# Altium project FMC_ADC_100M_10B_16CHA_TDC.PrjPCB (part 3 of 4)

## Sheet power_supply.SchDoc: FMC_ADC
size 420 x 297 mm; Author: G.Kasprowicz; CompanyName: WUT ISE; DrawnBy: G.Kasprowicz; Organization: WUT ISE; Address1: PW ISE; Address2: Nowowiejska 15/19 00-665 Warsaw; Address3: gkasprow@gmail.com; DocumentNumber: 10; Revision: 2; SheetNumber: 10; SheetTotal: 12; ModifiedBy: -; CheckedDate: -; Title2: Power supply; DivGrp: WUT ISE; Designer: G.Kasprowicz; ModifiedDate: -; ProjectName: Sensor Box
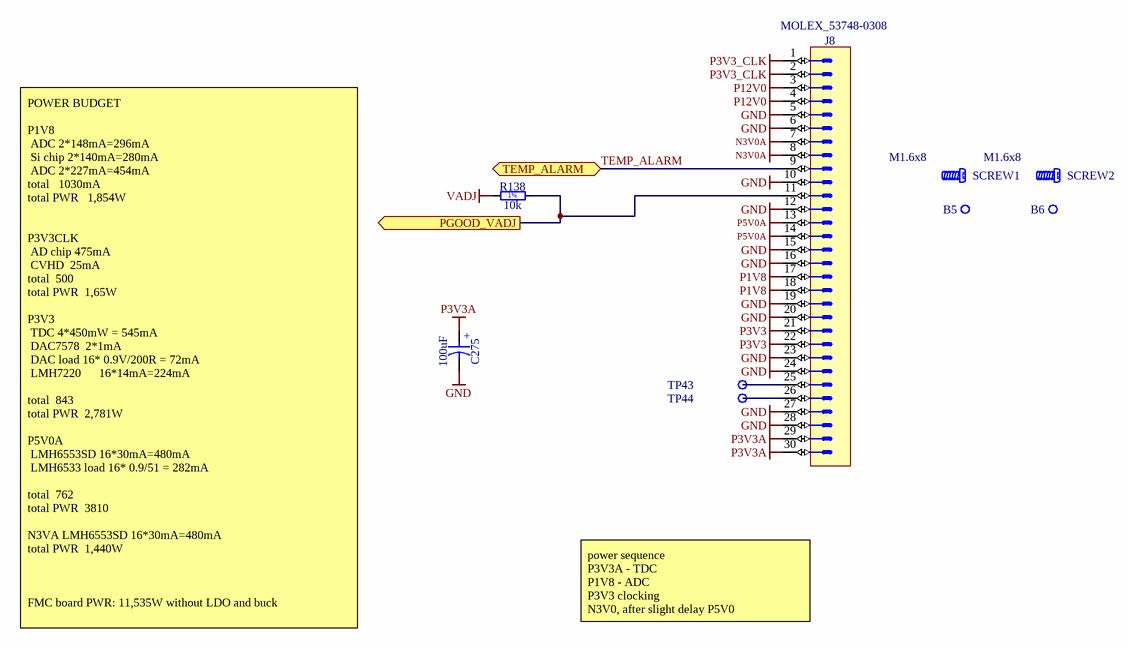
[diagram p6: power_supply.SchDoc]

### Parts
B5  Plated Hole  [c300h160]  (value not drawn)  (no BOM)
B6  Plated Hole  [c300h160]  (value not drawn)  (no BOM)
C275  100uF  [CAPMP3216X180N]
J8  SlimStack™  [MOLEX_53748-0308]  (value not drawn)
R138  10k  [RESC1005X40N]
SCREW1  M1.6x8  [BOSSARD_BN650-1243721_v]
SCREW2  M1.6x8  [BOSSARD_BN650-1243721_v]
TP43  Test Point  [TPS127]  (value not drawn)
TP44  Test Point  [TPS127]  (value not drawn)

### Ports
PGOOD_VADJ (out), TEMP_ALARM (bidir)

### Nets
GND: C275.2 J8.5 J8.6 J8.10 J8.12 J8.15 J8.16 J8.19 J8.20 J8.23 J8.24 J8.27 J8.28
N3V0A: J8.7 J8.8
P1V8: J8.17 J8.18
P3V3: J8.21 J8.22
P3V3_CLK: J8.1 J8.2
P3V3A: C275.1 J8.29 J8.30  [project net DVDD33]
P5V0A: J8.13 J8.14
P12V0: J8.3 J8.4
VADJ: R138.1
LA29_N: J8.11 R138.2 ; port PGOOD_VADJ
TEMP_ALARM: J8.9 ; port TEMP_ALARM
NetJ8_25: J8.25 TP43.1
NetJ8_26: J8.26 TP44.1

Not connected (* = marked no-connect by the designer): B5 1; B6 1

### Notes on the sheet
- POWER BUDGET
  P1V8
  ADC	2*148mA=296mA
  Si chip	2*140mA=280mA
  ADC	2*227mA=454mA
  total			1030mA
  total PWR			1,854W
  P3V3CLK
  AD chip	475mA
  CVHD 	25mA
  total		500
  total PWR		1,65W
  P3V3
  TDC	4*450mW = 545mA
  DAC7578	 2*1mA
  DAC load	16* 0.9V/200R = 72mA
  LMH7220	     16*14mA=224mA
  total		843
  total PWR		2,781W
  P5V0A
  LMH6553SD 16*30mA=480mA
  LMH6533 load 16* 0.9/51 = 282mA
  total		762
  total PWR		3810
  N3VA	LMH6553SD 16*30mA=480mA
  total PWR		1,440W
  FMC board PWR: 11,535W without LDO and buck
- power sequence
  P3V3A - TDC
  P1V8 - ADC
  P3V3 clocking
  N3V0, after slight delay P5V0
- Project/Equipment
- Document
- Designer
- Drawn by
- Check.by
- Copyright WUT ISE 2018.
  This documentation describes Open Hardware and is licensed under the CERN OHL v.1.1. You may redistribute and modify this documentation under the terms of the CERN OHL v.1.1. (http://ohwr.org/CERNOHL). This documentation is distributed WITHOUT ANY EXPRESS OR IMPLIED WARRANTY, INCLUDING OF MERCHANTABILITY, SATISFACTORY QUALITY AND FITNESS FOR A PARTICULAR PURPOSE. Please see the CERN OHL v.1.1 for applicable conditions.
- Contact
- File
- Last Mod.
- Print Date
- Sheet
- Size
- A3
- of
- Rev
- (in symbol CTE3216-18_100UF_6.3V_20%_ESR0500_AVX_TLJ) +
- (in symbol R0402_10K_1%_0.0625W_100PPM) 1%

### Library data of the parts
B5 B6 = PLATED_HOLE1.6_PAD3.0: Single Terminal Socket; Part Description: Plated Through Hole: Hole Dia.=1.6mm Pad Dia.=3.0mm; Mounted: No; Part Number: PLATED_HOLE1.6_PAD3.0; Component Type: Standard (No BOM); Pin Count: 1; Family: Plated Hole; Socket: No; SMD: No; Sense: No; Status: None; ComponentHeight: 0mm; HelpURL: Undefined; Author: CERN DEM JMW; CreateDate: 05.11.2009; LatestRevisionDate: 05.11.2009; PackageDescription: Plated Through Hole: Hole Dia.=1.6mm Pad Dia.=3.0mm
C275 = CTE3216-18_100UF_6.3V_20%_ESR0500_AVX_TLJ: Polarised capacitor; Part Description: ESR 0R5 Solid Tantalum Chip Capacitor; Manufacturer: AVX; Manufacturer Part Number: TLJA107M006R0500; Voltage: 6.3V; Tolerance: ±20%; Part Number: CTE3216-18_100UF_6.3V_20%_ESR0500_AVX_TLJ; Component Kind: Standard; Component Type: Standard; Pin Count: 2; Value: 100uF; Status: None; Case: A; Mounted: Yes; Socket: No; SMD: Yes; Sense: No; HelpURL: \\cern.ch\dfs\Applications\Altium\Datasheets\CTE_AVX_TLJ.pdf; Author: CERN DEM JLC; CreateDate: 19.12.2013; LatestRevisionDate: 19.12.2013; ComponentHeight: 1.8mm
J8 = MOLEX_53748-0308: Connector 30 Male; Part Description: 0.50mm Pitch SlimStack™ Dual Row 30 Circuits Surface Mount Vertical Plug (3.00 Stacking Heights); Manufacturer: MOLEX; PressFit: No; Part Number: MOLEX_53748-0308; Component Kind: Standard; Component Type: Standard; Pin Count: 30; Family: SlimStack™; Mounted: Yes; Socket: No; SMD: Yes; Sense: No; Status: None; Manufacturer Part Number: 53748-0308; ComponentHeight: 2.4mm; HelpURL: \\cern.ch\dfs\Applications\Altium\Datasheets\MOLEX_53748-0308.pdf; Author: CERN DEM JLC; CreateDate: 28.08.2012; LatestRevisionDate: 28.08.2012
R138 = R0402_10K_1%_0.0625W_100PPM: Resistor - 1%; Part Description: General Purpose Thick Film Chip Resistor; Manufacturer: GENERIC; Manufacturer1 Part Number: 232270671003L; TC: ±100ppm/°C; PressFit: No; Part Number: R0402_10K_1%_0.0625W_100PPM; Component Kind: Standard; Component Type: Standard; Pin Count: 2; Value: 10k; Status: Not Recommended; Power: 0.0625W; Tolerance: ±1%; Manufacturer Part Number: R0402_10K_1%_0.0625W_100PPM; Case: 0402; Mounted: Yes; Sense: No; Socket: No; SMD: Yes; Manufacturer1 Example: YAGEO PHYCOMP; Manufacturer1 ComponentHeight: 0.4mm; HelpURL: \\cern.ch\dfs\Applications\Altium\Datasheets\R0402_Phycomp_RC0402.pdf; Author: CERN DEM JLC; CreateDate: 03.12.2007; LatestRevisionDate: 17.10.2012
SCREW1 SCREW2 = BOSSARD_BN650-1243721_v: Screw; Part Description: M1.6 L=8mm Slotted Cheese Head Machine Screw, DIN 84 A, Stainless Steel A2; Manufacturer Part Number: BN650 Art.1243721; PressFit: No; Part Number: BOSSARD_BN650-1243721_v; Component Kind: Standard; Component Type: Mechanical; Pin Count: 0; PackageDescription: M1.6 L=8mm Slotted Cheese Head Machine Screw, DIN 84 A, Stainless Steel A2; Mounted: Yes; Socket: No; SMD: No; Sense: No; Status: None; Value: M1.6x8; Manufacturer: BOSSARD; ComponentHeight: 1mm; HelpURL: \\cern.ch\dfs\Applications\Altium\Datasheets\BOSSARD_BN650-1243721.pdf; Author: CERN DEM JMW; CreateDate: 04.12.2015; LatestRevisionDate: 04.12.2015
TP43 TP44 = SMD_PAD_1.27X1.27MM: as TP35-TP40 on sheet FMC connector; Part Number: SMD_PAD_1.27X1.27MM; Component Kind: Standard (No BOM); Component Type: Standard (No BOM); Pin Count: 1; Family: Test Point; Socket: No; SMD: Yes; Sense: No; Status: None; ComponentHeight: 0mm; HelpURL: Undefined; Author: CERN DEM JLC; CreateDate: 12.01.2008; LatestRevisionDate: 12.01.2008; PackageDescription: 1.27mm x 1.27mm PCB Copper Area (SMD Test Point)

## Sheet IDX_CTRL.SchDoc: FMC_ADC
size 420 x 297 mm; Author: G.Kasprowicz; CompanyName: WUT ISE; DrawnBy: G.Kasprowicz; Organization: WUT ISE; Address1: PW ISE; Address2: Nowowiejska 15/19 00-665 Warsaw; Address3: gkasprow@gmail.com; DocumentNumber: 8; Revision: 2; SheetNumber: 8; SheetTotal: 12; ModifiedBy: -; CheckedDate: -; Title2: TDC INDEX signal distribution; DivGrp: WUT ISE; Designer: G.Kasprowicz; ModifiedDate: -; ProjectName: Sensor Box
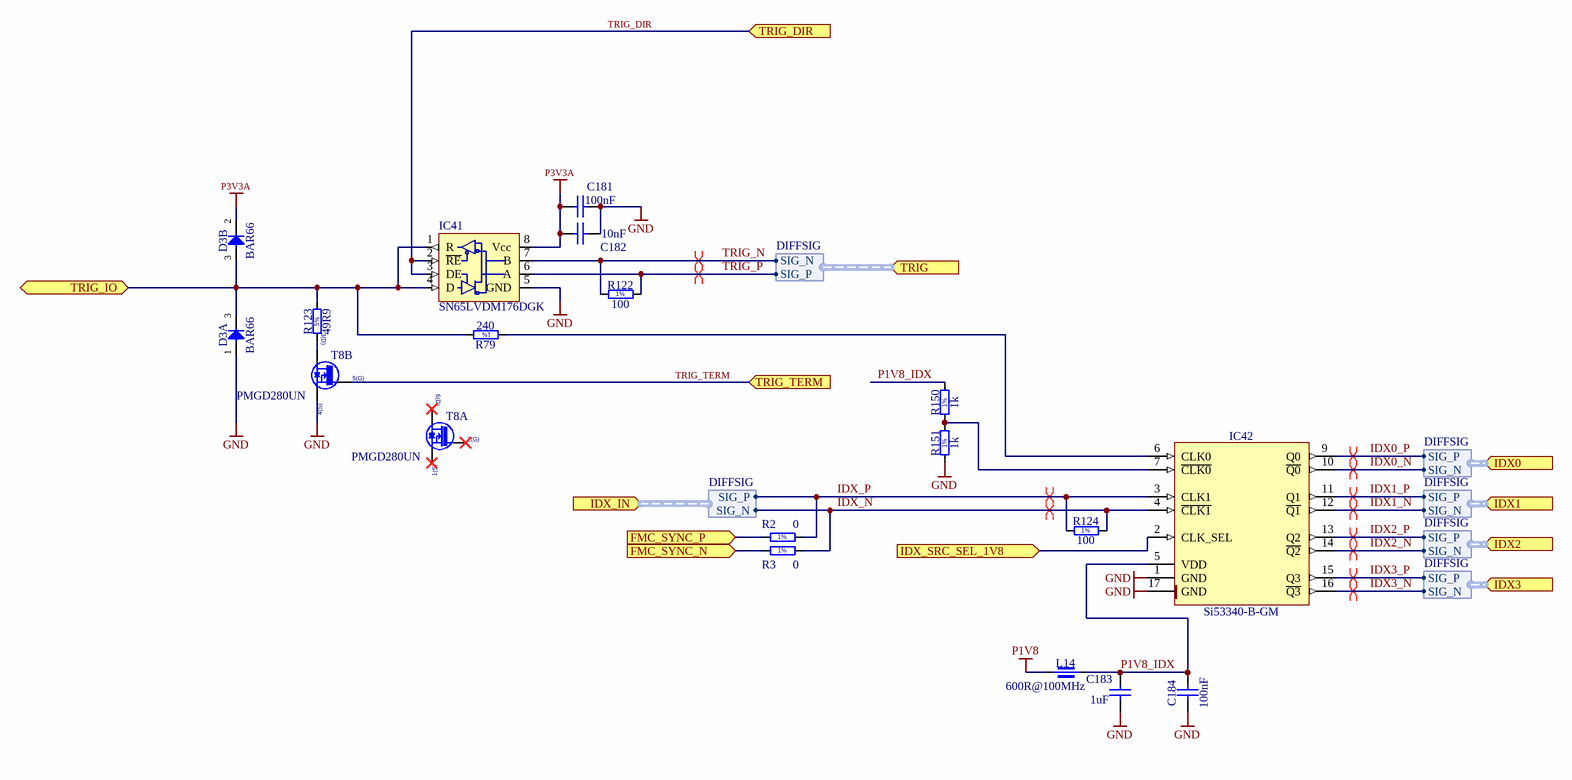
[diagram p7: IDX_CTRL.SchDoc]

### Parts
C181  100nF  [CAPC0603X33N]
C182  10nF  [CAPC0603X33N]
C183  1uF  [CAPC1005X55N]
C184  100nF  [CAPC0603X33N]
D3  BAR66  [SOT95P240X110-3N]  (parts A,B of 2)
IC41  SN65LVDM176DGK  [MSOP8 TI/AD]
IC42  Si53340-B-GM  [QFN50P300X300X90-17N-S175]
L14  600R@100MHz  [INDC1005X55N]
R2  0  [RESC1005X40N]
R3  0  [RESC1005X40N]
R79  240  [RESC1005X40N]
R122  100  [RESC0603X28N]
R123  49R9  [RESC3225X70N]
R124  100  [RESC0603X28N]
R150  1k  [RESC1005X40N]
R151  1k  [RESC1005X40N]
T8  PMGD280UN  [SOT65P210X110-6N]  (parts A,B of 2)

### Ports
FMC_SYNC_N (in), FMC_SYNC_P (in), IDX0 (in, harness DIFFSIG), IDX1 (in, harness DIFFSIG), IDX2 (in, harness DIFFSIG), IDX3 (in, harness DIFFSIG), IDX_IN (in, harness DIFFSIG), IDX_SRC_SEL_1V8 (in), TRIG (in, harness DIFFSIG), TRIG_DIR (in), TRIG_IO (bidir), TRIG_TERM (in)

### Harnesses
DIFFSIG: SIG_N, SIG_P

### Nets
GND: C181.2 C182.2 C183.1 C184.1 D3.1(A) IC41.5(GND) IC42.1(GND) IC42.17(GND) R151.1 T8.4(S)
P1V8: L14.1
P3V3A: C181.1 C182.1 D3.2(C) IC41.8(Vcc)  [project net DVDD33]
CLK2_BIDIR_N: R3.1 ; port FMC_SYNC_N
CLK2_BIDIR_P: R2.1 ; port FMC_SYNC_P
IDX0_N: IC42.10(~{Q0}) ; port IDX0.SIG_N  [project net IDX0.SIG_N]
IDX0_P: IC42.9(Q0) ; port IDX0.SIG_P  [project net IDX0.SIG_P]
IDX1_N: IC42.12(~{Q1}) ; port IDX1.SIG_N  [project net IDX1.SIG_N]
IDX1_P: IC42.11(Q1) ; port IDX1.SIG_P  [project net IDX1.SIG_P]
IDX2_N: IC42.14(~{Q2}) ; port IDX2.SIG_N  [project net IDX2.SIG_N]
IDX2_P: IC42.13(Q2) ; port IDX2.SIG_P  [project net IDX2.SIG_P]
IDX3_N: IC42.16(~{Q3}) ; port IDX3.SIG_N  [project net IDX3.SIG_N]
IDX3_P: IC42.15(Q3) ; port IDX3.SIG_P  [project net IDX3.SIG_P]
IDX_N: IC42.4(~{CLK1}) R3.2 R124.2 ; port IDX_IN.SIG_N
IDX_P: IC42.3(CLK1) R2.2 R124.1 ; port IDX_IN.SIG_P
IDX_SRC_SEL_1V8: IC42.2(CLK_SEL) ; port IDX_SRC_SEL_1V8
P1V8_IDX: C183.2 C184.2 IC42.5(VDD) L14.2 R150.2
TRIG_DIR: IC41.2(~{RE}) IC41.3(DE) ; port TRIG_DIR
TRIG_N: IC41.7(B) R122.1 ; port TRIG.SIG_N  [project net HB12_N]
TRIG_P: IC41.6(A) R122.2 ; port TRIG.SIG_P  [project net HB12_P]
TRIG_TERM: T8.5(G) ; port TRIG_TERM
NetD3_3: D3.3(COMAC) IC41.1(R) IC41.4(D) R79.2 R123.2 ; port TRIG_IO
NetIC42_6: IC42.6(CLK0) R79.1
NetIC42_7: IC42.7(~{CLK0}) R150.1 R151.2
NetR123_1: R123.1 T8.3(D)

Not connected (* = marked no-connect by the designer): T8 1(S)* 2(G)* 6(D)*

### Layout directives
differential pair: HB12_N, HB12_P, IDX0.SIG_N, IDX0.SIG_P, IDX1.SIG_N, IDX1.SIG_P, IDX2.SIG_N, IDX2.SIG_P, IDX3.SIG_N, IDX3.SIG_P, IDX_N, IDX_P

### Notes on the sheet
- Project/Equipment
- Document
- Designer
- Drawn by
- Check.by
- Copyright WUT ISE 2018.
  This documentation describes Open Hardware and is licensed under the CERN OHL v.1.1. You may redistribute and modify this documentation under the terms of the CERN OHL v.1.1. (http://ohwr.org/CERNOHL). This documentation is distributed WITHOUT ANY EXPRESS OR IMPLIED WARRANTY, INCLUDING OF MERCHANTABILITY, SATISFACTORY QUALITY AND FITNESS FOR A PARTICULAR PURPOSE. Please see the CERN OHL v.1.1 for applicable conditions.
- Contact
- File
- Last Mod.
- Print Date
- Sheet
- Size
- A3
- of
- Rev
- (in symbol PMGD280UN, part A) 6(D); 2(G); 1(S)
- (in symbol PMGD280UN, part B) 3(D); 5(G); 4(S)
- (in symbol R0201_100R_1%_0.05W_200PPM) 1%
- (in symbol R0402_0R_JUMPER) 1%
- (in symbol R0402_1K_1%_0.0625W_100PPM) 1%
- (in symbol R0402_240R_1%_0.0625W_100PPM) 1%
- (in symbol R1210_270R_5%_0.5W_200PPM) 5%

### Library data of the parts
C181 = CC0201_100NF_6.3V_10%_X5R: Non-polarised capacitor; Part Description: SMD Multilayer Chip Ceramic Capacitor; Manufacturer: GENERIC; Manufacturer1 Part Number: 02016D104KAT2A; Voltage: 6.3V; TC: X5R; Tolerance: ±10%; Table: Capacitors SMD; Part Number: CC0201_100NF_6.3V_10%_X5R; Component Kind: Standard; Component Type: Standard; Pin Count: 2; Value: 100nF; Status: Not Recommended; Manufacturer Part Number: CC0201_100NF_6.3V_10%_X5R; Case: 0201; Mounted: Yes; Socket: No; SMD: Yes; Manufacturer1 Example: AVX; Manufacturer1 ComponentHeight: 0.33mm; HelpURL: \\cern.ch\dfs\Applications\Altium\Datasheets\CC0201_X5R_AVX.pdf; Author: CERN DEM JLC; CreateDate: 2007-12-03; LatestRevisionDate: 2007-12-03
C182 = CC0201_10NF_10V_10%_X5R: Non-polarised capacitor; Part Description: SMD Multilayer Chip Ceramic Capacitor; Manufacturer: GENERIC; Manufacturer1 Part Number: 0201ZD103KAT2A; Voltage: 10V; TC: X5R; Tolerance: ±10%; Table: Capacitors SMD; Part Number: CC0201_10NF_10V_10%_X5R; Component Kind: Standard; Component Type: Standard; Pin Count: 2; Value: 10nF; Status: Not Recommended; Manufacturer Part Number: CC0201_10NF_10V_10%_X5R; Case: 0201; Mounted: Yes; Socket: No; SMD: Yes; Manufacturer1 Example: AVX; Manufacturer1 ComponentHeight: 0.33mm; HelpURL: \\cern.ch\dfs\Applications\Altium\Datasheets\CC0201_X5R_AVX.pdf; Author: CERN DEM JLC; CreateDate: 2007-12-03; LatestRevisionDate: 2007-12-03
C183 = CC0402_1UF_16V_10%_X5R: Non-polarised capacitor; Part Description: SMD Multilayer Chip Ceramic Capacitor; Manufacturer: GENERIC; Manufacturer1 Part Number: C1005X5R1C105KT; Voltage: 16V; TC: X5R; Tolerance: ±10%; Part Number: CC0402_1UF_16V_10%_X5R; Component Kind: Standard; Component Type: Standard; Pin Count: 2; Value: 1uF; Status: Preferred; Manufacturer Part Number: CC0402_1UF_16V_10%_X5R; Case: 0402; Mounted: Yes; Socket: No; SMD: Yes; Sense: No; Manufacturer1 Example: TDK; Manufacturer1 ComponentHeight: 0.55mm; HelpURL: \\cern.ch\dfs\Applications\Altium\Datasheets\CC0402_X5R_TDK_C.pdf; Author: CERN DEM JLC; CreateDate: 2012-10-25; LatestRevisionDate: 2012-10-25
C184 = CC0201_100NF_6.3V_10%_X5R: Non-polarised capacitor; Part Description: SMD Multilayer Chip Ceramic Capacitor; Manufacturer: GENERIC; Manufacturer1 Part Number: 02016D104KAT2A; Voltage: 6.3V; TC: X5R; Tolerance: ±10%; Part Number: CC0201_100NF_6.3V_10%_X5R; Component Kind: Standard; Component Type: Standard; Pin Count: 2; Value: 100nF; Status: Not Recommended; Manufacturer Part Number: CC0201_100NF_6.3V_10%_X5R; Case: 0201; Mounted: Yes; Socket: No; SMD: Yes; Sense: No; Manufacturer1 Example: AVX; Manufacturer1 ComponentHeight: 0.33mm; HelpURL: \\cern.ch\dfs\Applications\Altium\Datasheets\CC0201_X5R_AVX.pdf; Author: CERN DEM JLC; CreateDate: 03.12.2007; LatestRevisionDate: 03.12.2007
D3 = BAR66: Serial Diode; Part Description: Silicon PIN Diode Array (Series Connected); Manufacturer: INFINEON; Voltage: 150V; Power: 250mA; Table: Diodes; Part Number: BAR66; Component Kind: Standard; Component Type: Standard; Device: BAR66; PackageDescription: SOT23 3-Leads, Pitch 0.95mm - Body 1.3x2.9mm, IPC Medium Density; Manufacturer Part Number: BAR66; Pin Count: 3; Case: SOT23; Mounted: Yes; Socket: No; SMD: Yes; ComponentHeight: 1.1mm; HelpURL: \\cern.ch\dfs\Applications\Altium\Datasheets\BAR66.pdf; Author: CERN DEM JLC; CreateDate: 18/1/2010; LatestRevisionDate: 5/10/2010
IC41 = SN65LVDM176: High Speed Differential Transceiver LVDS/LVTTL; ComponentLink1Description: Datasheet; ComponentLink1URL: C:\TSR\Laurin\Projects\FMC\CERN DAC\Parts\Digital\SN65LVDM176.pdf
IC42 = Si53340-B-GM: Low-Jitter LVDS Fanout Clock Buffers, 10-Output,  Any-Input, Any-Frequency up to 1250MHz; Manufacturer: SILICON LABS; PressFit: No; Bonding: No; Part Number: Si53340-B-GM; Component Kind: Standard; Component Type: Standard; Device: Si53340-B-GM; PackageDescription: QFN, 0.50mm Pitch, Square; 16 Pin, 3.00mm L X 3.00mm W X 0.90mm H Body (w/thermal tab 1.75mm x 1.75mm), IPC Medium Density; Part Description: Low-Jitter LVDS Fanout Clock Buffers, 10-Output,  Any-Input, Any-Frequency up to 1250MHz; Manufacturer Part Number: Si53340-B-GM; Pin Count: 17; Case: QFN16; Mounted: Yes; Socket: No; SMD: Yes; Sense: No; ComponentHeight: 0.9mm; HelpURL: \\cern.ch\dfs\Applications\Altium\Datasheets\Si53340-B-GM.pdf; Author: CERN DEM MR; CreateDate: 04.09.2017; LatestRevisionDate: 04.09.2017
L14 = IND0402_MURATA_BLM15HD601SN1: Part Description: SMD EMIFIL Suppression Chip Ferrite Bead; Manufacturer: MURATA; Manufacturer Part Number: BLM15HD601SN1D; Power: 300mA; Resistance: 0.85R; Tolerance: ±25%; Part Number: IND0402_MURATA_BLM15HD601SN1; Component Kind: Standard; Component Type: Standard; Pin Count: 2; Value: 600R@100MHz; Status: None; Case: 0402; Mounted: Yes; Socket: No; SMD: Yes; Sense: No; ComponentHeight: 0.55mm; HelpURL: \\cern.ch\dfs\Applications\Altium\Datasheets\IND0402_MURATA_BLM15H.pdf; Author: CERN DEM JLC; CreateDate: 28.02.2012; LatestRevisionDate: 25.10.2018
R2 R3 = R0402_0R_JUMPER: Resistor - 1%; Part Description: 1A (0.05R Max DC Resistance) Zero Ohm Jumper; Manufacturer: GENERIC; Manufacturer1 Part Number: 232270591001L; Table: Resistors SMD; Part Number: R0402_0R_JUMPER; Component Kind: Standard; Component Type: Standard; Pin Count: 2; Value: 0; Status: Not recommended; Manufacturer Part Number: R0402_0R_JUMPER; Case: 0402; Mounted: Yes; Socket: No; SMD: Yes; Manufacturer1 Example: YAGEO PHYCOMP; Manufacturer1 ComponentHeight: 0.4mm; HelpURL: \\cern.ch\dfs\Applications\Altium\Datasheets\R0402_Phycomp_RC0402.pdf; Author: CERN DEM JLC; CreateDate: 3/12/2007; LatestRevisionDate: 17/10/2012
R79 = R0402_240R_1%_0.0625W_100PPM: Resistor - 1%; Part Description: General Purpose Thick Film Chip Resistor; Manufacturer: GENERIC; Manufacturer1 Part Number: 232270672401L; TC: ±100ppm/°C; PressFit: No; Part Number: R0402_240R_1%_0.0625W_100PPM; Component Kind: Standard; Component Type: Standard; Pin Count: 2; Value: 240; Status: Not Recommended; Power: 0.0625W; Tolerance: ±1%; Manufacturer Part Number: R0402_240R_1%_0.0625W_100PPM; Case: 0402; Mounted: Yes; Sense: No; Socket: No; SMD: Yes; Manufacturer1 Example: YAGEO PHYCOMP; Manufacturer1 ComponentHeight: 0.4mm; HelpURL: \\cern.ch\dfs\Applications\Altium\Datasheets\R0402_Phycomp_RC0402.pdf; Author: CERN DEM JLC; CreateDate: 03.12.2007; LatestRevisionDate: 17.10.2012
R122 R124 = R0201_100R_1%_0.05W_200PPM: Resistor - 1%; Part Description: Thick Film Chip Resistor; Manufacturer: GENERIC; Manufacturer1 Part Number: CRCW0201100RFNED; Power: 0.05W; TC: ±200ppm/°C; PressFit: No; Part Number: R0201_100R_1%_0.05W_200PPM; Component Kind: Standard; Component Type: Standard; Pin Count: 2; Value: 100; Status: Not Recommended; Tolerance: ±1%; Manufacturer Part Number: R0201_100R_1%_0.05W_200PPM; Case: 0201; Mounted: Yes; Socket: No; SMD: Yes; Manufacturer1 Example: VISHAY; Manufacturer1 ComponentHeight: 0.27mm; HelpURL: \\cern.ch\dfs\Applications\Altium\Datasheets\R0201_VISHAY_CRCW0201 e3.pdf; Author: CERN DEM JLC; CreateDate: 13.11.2014; LatestRevisionDate: 13.11.2014; Sense: No
R123 = R1210_270R_5%_0.5W_200PPM: Resistor - 5%; Part Number: R1210_49R9_1%_0.33W_100PPM; Part Description: General Purpose Thick Film Chip Resistor; Manufacturer: VISHAY; Manufacturer Part Number: CRCW121049R9FK; Power: 0.33W; TC: ±100ppm/°C; Table: Resistors SMD; Component Kind: Standard; Component Type: Standard; Pin Count: 2; Value: 49R9; Status: None; Tolerance: ±5%; Case: 1210; Mounted: Yes; Socket: No; SMD: Yes; ComponentHeight: 0.7mm; HelpURL: \\cern.ch\dfs\Applications\Altium\Datasheets\R1210_PANASONIC_ERJ.pdf; Author: CERN DEM JLC; CreateDate: 2011-10-26; LatestRevisionDate: 2011-10-26
R150 R151 = R0402_1K_1%_0.0625W_100PPM: Resistor - 1%; Part Description: General Purpose Thick Film Chip Resistor; Manufacturer: GENERIC; Manufacturer1 Part Number: 232270671002L; TC: ±100ppm/°C; Tolerance: ±1%; Value: 1k; Power: 0.0625W; Part Number: R0402_1K_1%_0.0625W_100PPM; Component Kind: Standard; Component Type: Standard; Pin Count: 2; Status: Not recommended; Manufacturer Part Number: R0402_1K_1%_0.0625W_100PPM; Case: 0402; Mounted: Yes; Sense: No; Socket: No; SMD: Yes; Manufacturer1 Example: YAGEO PHYCOMP; Manufacturer1 ComponentHeight: 0.4mm; HelpURL: \\cern.ch\dfs\Applications\Altium\Datasheets\R0402_Phycomp_RC0402.pdf; Author: CERN DEM JLC; CreateDate: 03.12.2007; LatestRevisionDate: 17.10.2012
T8 = PMGD280UN: Dual N-Channel micro TrenchMOS™ Ultra Low Level FET; Part Description: 20V 870mA Dual N-Channel micro TrenchMOS™ Ultra Low Level FET; Manufacturer: NXP SEMICONDUCTORS; PressFit: No; Bonding: No; Part Number: PMGD280UN; Component Kind: Standard; Component Type: Standard; Device: PMGD280UN; PackageDescription: SOT363, SC70-6, SOT, 0.65mm Pitch, 6 pin, 1.25mm W X 2.00mm L X 1.10mm H, IPC Medium Density; Manufacturer Part Number: PMGD280UN; Pin Count: 6; Case: SOT363; Mounted: Yes; Socket: No; SMD: Yes; Sense: No; ComponentHeight: 1.1mm; HelpURL: \\cern.ch\dfs\Applications\Altium\Datasheets\PMGD280UN.pdf; Author: CERN DEM JLC; CreateDate: 19.11.2014; LatestRevisionDate: 19.11.2014

## Sheet CFD.SchDoc: FMC_ADC
size 420 x 297 mm; Author: G.Kasprowicz; CompanyName: WUT ISE; DrawnBy: G.Kasprowicz; Organization: WUT ISE; Address1: PW ISE; Address2: Nowowiejska 15/19 00-665 Warsaw; Address3: gkasprow@gmail.com; DocumentNumber: 3; Revision: 2; SheetNumber: 3; SheetTotal: 12; ModifiedBy: -; CheckedDate: -; Title2: CFD, ADC driver; DivGrp: WUT ISE; Designer: G.Kasprowicz; ModifiedDate: -; ProjectName: Sensor Box
Used 16 times, as channels U_CFD0, U_CFD1, U_CFD2, U_CFD3, U_CFD4, U_CFD5, U_CFD6, U_CFD7, U_CFD8, U_CFD9, U_CFD10, U_CFD11, U_CFD12, U_CFD13, U_CFD14, U_CFD15. Parts and nets are listed once, with the designators drawn on the sheet.
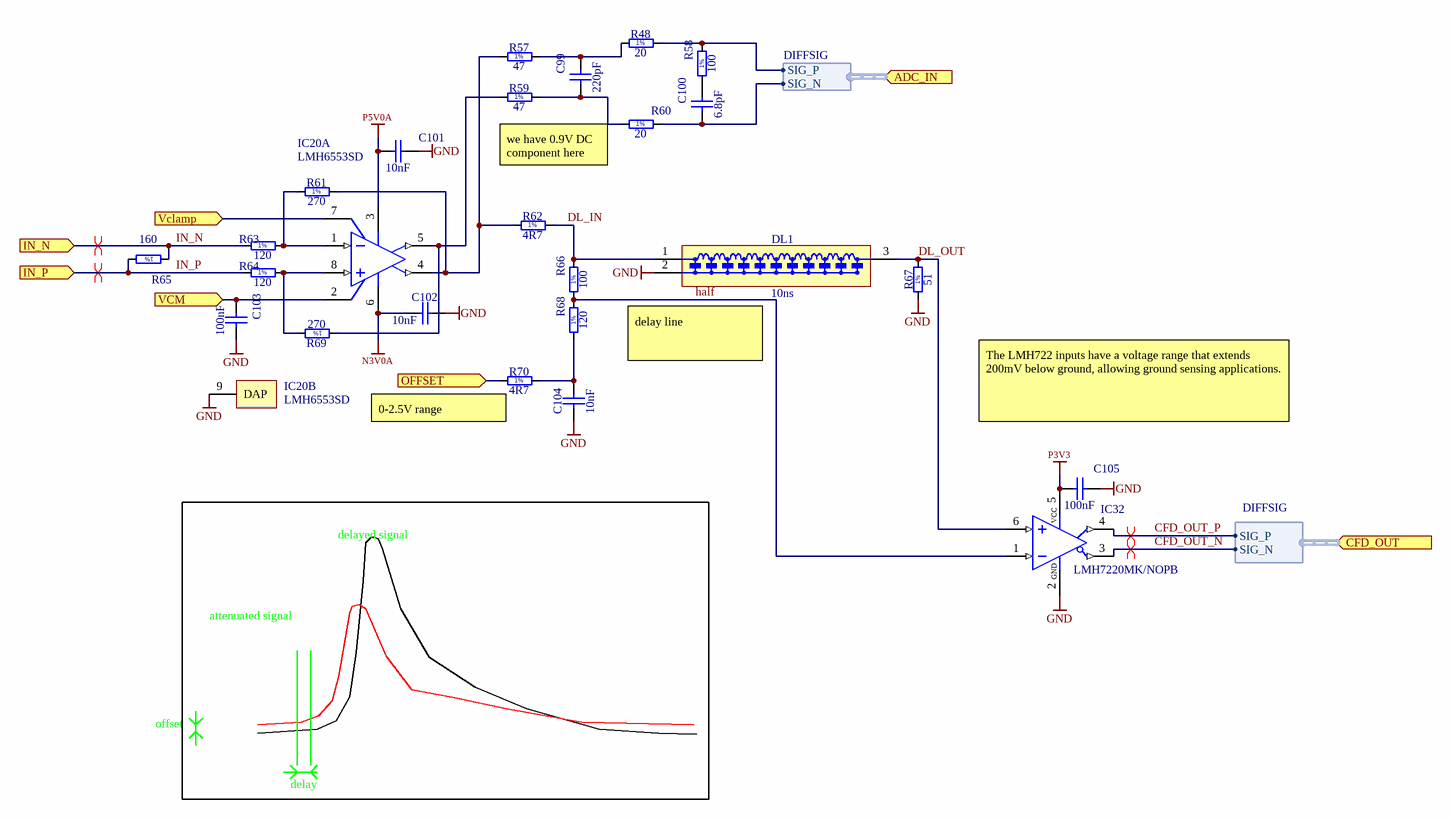
[diagram p8: CFD.SchDoc]

### Parts
C99  220pF  [CAPC1005X55N]
C100  6.8pF  [CAPC1005X70N]
C101  10nF  [CAPC0603X33N]
C102  10nF  [CAPC0603X33N]
C103  100nF  [CAPC0603X33N]
C104  10nF  [CAPC1005X55N]
C105  100nF  [CAPC0603X33N]
DL1  10ns  [DS1L]
IC20  LMH6553SD  [SDA08C]  (parts A,B of 2)
IC32  LMH7220MK/NOPB  [SOT95P285X100-6N]
R48  20  [RESC1005X40N]
R57  47  [RESC1005X40N]
R58  100  [RESC0603X28N]
R59  47  [RESC1005X40N]
R60  20  [RESC1005X40N]
R61  270  [RESC1005X40N]
R62  4R7  [RESC1005X40N]
R63  120  [RESC1005X40N]
R64  120  [RESC1005X40N]
R65  160  [RESC1005X40N]
R66  100  [RESC0603X28N]
R67  51  [RESC1005X40N]
R68  120  [RESC1005X40N]
R69  270  [RESC1005X40N]
R70  4R7  [RESC1005X40N]

### Ports
ADC_IN (in, harness DIFFSIG), CFD_OUT (in, harness DIFFSIG), IN_N (in), IN_P (in), OFFSET (in), Vclamp (in), VCM (in)

### Harnesses
DIFFSIG: SIG_P, SIG_N

### Nets
GND: C101.2 C102.2 C103.2 C104.1 C105.2 DL1.2(IN) IC20.9(DAP) IC32.2(GND) R67.1
N3V0A: C102.1 IC20.6(V-)
P3V3: C105.1 IC32.5(VCC)
P5V0A: C101.1 IC20.3(V+)
CFD_OUT_N: IC32.3(VOUT~{Q}) ; port CFD_OUT.SIG_N
CFD_OUT_P: IC32.4(VOUTQ) ; port CFD_OUT.SIG_P
DL_IN: DL1.1(GND) R62.2 R66.2
DL_OUT: DL1.3(OUT) IC32.6(IN+) R67.2
half: IC32.1(IN-) R66.1 R68.2
IN_N: R63.1 R65.1 ; port IN_N
IN_P: R64.1 R65.2 ; port IN_P
OFFSET: R70.1 ; port OFFSET
Vclamp: IC20.7(VCLAMP) ; port Vclamp
VCM: C103.1 IC20.2(VCM) ; port VCM
NetC99_1: C99.1 R59.2 R60.1
NetC99_2: C99.2 R48.1 R57.2
NetC100_1: C100.1 R60.2 ; port ADC_IN.SIG_N
NetC100_2: C100.2 R58.1
NetC104_2: C104.2 R68.1 R70.2
NetIC20_1: IC20.1(IN-) R61.1 R63.2
NetIC20_4: IC20.4(OUT+) R57.1 R61.2 R62.1
NetIC20_5: IC20.5(OUT-) R59.1 R69.1
NetIC20_8: IC20.8(IN+) R64.2 R69.2
NetR48_2: R48.2 R58.2 ; port ADC_IN.SIG_P

### Channels
U_CFD0: designators end in A; ports IN_N=IN0_N IN_P=IN0_P OFFSET=CFD_OFFSET0 Vclamp=CFD_CLAMP VCM=VCM0
U_CFD1: designators end in B; ports IN_N=IN1_N IN_P=IN1_P OFFSET=CFD_OFFSET1 Vclamp=CFD_CLAMP VCM=VCM0
U_CFD2: designators end in C; ports IN_N=IN2_N IN_P=IN2_P OFFSET=CFD_OFFSET2 Vclamp=CFD_CLAMP VCM=VCM0
U_CFD3: designators end in D; ports IN_N=IN3_N IN_P=IN3_P OFFSET=CFD_OFFSET3 Vclamp=CFD_CLAMP VCM=VCM0
U_CFD4: designators end in E; ports IN_N=IN4_N IN_P=IN4_P OFFSET=CFD_OFFSET4 Vclamp=CFD_CLAMP VCM=VCM0
U_CFD5: designators end in F; ports IN_N=IN5_N IN_P=IN5_P OFFSET=CFD_OFFSET5 Vclamp=CFD_CLAMP VCM=VCM0
U_CFD6: designators end in G; ports IN_N=IN6_N IN_P=IN6_P OFFSET=CFD_OFFSET6 Vclamp=CFD_CLAMP VCM=VCM0
U_CFD7: designators end in H; ports IN_N=IN7_N IN_P=IN7_P OFFSET=CFD_OFFSET7 Vclamp=CFD_CLAMP VCM=VCM0
U_CFD8: designators end in I; ports IN_N=IN8_N IN_P=IN8_P OFFSET=CFD_OFFSET8 Vclamp=CFD_CLAMP VCM=VCM1
U_CFD9: designators end in J; ports IN_N=IN9_N IN_P=IN9_P OFFSET=CFD_OFFSET9 Vclamp=CFD_CLAMP VCM=VCM1
U_CFD10: designators end in K; ports IN_N=IN10_N IN_P=IN10_P OFFSET=CFD_OFFSET10 Vclamp=CFD_CLAMP VCM=VCM1
U_CFD11: designators end in L; ports IN_N=IN11_N IN_P=IN11_P OFFSET=CFD_OFFSET11 Vclamp=CFD_CLAMP VCM=VCM1
U_CFD12: designators end in M; ports IN_N=IN12_N IN_P=IN12_P OFFSET=CFD_OFFSET12 Vclamp=CFD_CLAMP VCM=VCM1
U_CFD13: designators end in N; ports IN_N=IN13_N IN_P=IN13_P OFFSET=CFD_OFFSET13 Vclamp=CFD_CLAMP VCM=VCM1
U_CFD14: designators end in O; ports IN_N=IN14_N IN_P=IN14_P OFFSET=CFD_OFFSET14 Vclamp=CFD_CLAMP VCM=VCM1
U_CFD15: designators end in P; ports IN_N=IN15_N IN_P=IN15_P OFFSET=CFD_OFFSET15 Vclamp=CFD_CLAMP VCM=VCM1

### Layout directives
differential pair: CFD_OUT0.SIG_N, CFD_OUT0.SIG_P, IN0_N, IN0_P

### Notes on the sheet
- we have 0.9V DC component here
- delay line
- (near R70) 0-2.5V range
- The LMH722 inputs have a voltage range that extends  200mV below ground, allowing ground sensing applications.
- delayed signal
- attenuated signal
- offset
- delay
- Project/Equipment
- Document
- Designer
- Drawn by
- Check.by
- Copyright WUT ISE 2018.
  This documentation describes Open Hardware and is licensed under the CERN OHL v.1.1. You may redistribute and modify this documentation under the terms of the CERN OHL v.1.1. (http://ohwr.org/CERNOHL). This documentation is distributed WITHOUT ANY EXPRESS OR IMPLIED WARRANTY, INCLUDING OF MERCHANTABILITY, SATISFACTORY QUALITY AND FITNESS FOR A PARTICULAR PURPOSE. Please see the CERN OHL v.1.1 for applicable conditions.
- Contact
- File
- Last Mod.
- Print Date
- Sheet
- Size
- A3
- of
- Rev
- (in symbol R0201_100R_1%_0.05W_200PPM) 1%
- (in symbol R0402_4R7_1%_0.0625W_200PPM) 1%
- (in symbol R0402_20R_1%_0.0625W_100PPM) 1%
- (in symbol R0402_47R_1%_0.0625W_100PPM) 1%
- (in symbol R0402_51R_1%_0.0625W_100PPM) 1%
- (in symbol R0402_120R_1%_0.0625W_100PPM) 1%
- (in symbol R0402_160R_1%_0.0625W_100PPM) 1%
- (in symbol R0402_270R_1%_0.0625W_100PPM) 1%

### Library data of the parts
C99 = CC0402_220PF_50V_5%_C0G: Non-polarised capacitor; Part Description: SMD Multilayer Chip Ceramic Capacitor; Manufacturer: GENERIC; Manufacturer1 Part Number: C0402C221J5GACTU; Voltage: 50V; TC: C0G/NP0; Tolerance: ±5%; Part Number: CC0402_220PF_50V_5%_C0G; Component Kind: Standard; Component Type: Standard; Pin Count: 2; Value: 220pF; Status: Preferred; Manufacturer Part Number: CC0402_220PF_50V_5%_C0G; Case: 0402; Mounted: Yes; Socket: No; SMD: Yes; Sense: No; Manufacturer1 ComponentHeight: 0.55mm; HelpURL: \\cern.ch\dfs\Applications\Altium\Datasheets\CC0805_C0G_KEMET_(Commercial Grade).pdf; Author: CERN DEM JLC; CreateDate: 03.12.2007; LatestRevisionDate: 22.04.2015; Manufacturer1 Example: KEMET
C100 = CC0402_6.8PF_50V_0.25PF_C0G_VISHAY_VJ_NON-MAGNETIC: Non-polarised capacitor; Part Description: Surface Mount Multilayer Ceramic Chip Capacitors for Non-Magnetic Applications (IR Reflow Soldering); Manufacturer: VISHAY VITRAMON; Manufacturer Part Number: VJ0402A6R8CCAA; Voltage: 50V; TC: C0G/NP0; Tolerance: ±0.25pF; Part Number: CC0402_6.8PF_50V_0.25PF_C0G_VISHAY_VJ_NON-MAGNETIC; Component Kind: Standard; Component Type: Standard; Pin Count: 2; Value: 6.8pF; Status: Not Recommended; Case: 0402; Mounted: Yes; Socket: No; SMD: Yes; Sense: No; ComponentHeight: 0.64mm; HelpURL: \\cern.ch\dfs\Applications\Altium\Datasheets\CC0402_VISHAY_VJ_NON-MAGNETIC.pdf; Author: CERN DEM MR; CreateDate: 22.06.2016; LatestRevisionDate: 03.03.2017
C101 C102 = CC0201_10NF_10V_10%_X5R: Non-polarised capacitor; Part Description: SMD Multilayer Chip Ceramic Capacitor; Manufacturer: GENERIC; Manufacturer1 Part Number: 0201ZD103KAT2A; Voltage: 10V; TC: X5R; Tolerance: ±10%; Part Number: CC0201_10NF_10V_10%_X5R; Component Kind: Standard; Component Type: Standard; Pin Count: 2; Value: 10nF; Status: Not Recommended; Manufacturer Part Number: CC0201_10NF_10V_10%_X5R; Case: 0201; Mounted: Yes; Socket: No; SMD: Yes; Sense: No; Manufacturer1 Example: AVX; Manufacturer1 ComponentHeight: 0.33mm; HelpURL: \\cern.ch\dfs\Applications\Altium\Datasheets\CC0201_X5R_AVX.pdf; Author: CERN DEM JLC; CreateDate: 03.12.2007; LatestRevisionDate: 03.12.2007
C103 C105 = CC0201_100NF_6.3V_10%_X5R: as C184 on sheet IDX_CTRL; Part Number: CC0201_100NF_6.3V_10%_X5R; Component Kind: Standard; Component Type: Standard; Pin Count: 2; Value: 100nF; Status: Not Recommended; Manufacturer Part Number: CC0201_100NF_6.3V_10%_X5R; Case: 0201; Mounted: Yes; Socket: No; SMD: Yes; Sense: No; Manufacturer1 Example: AVX; Manufacturer1 ComponentHeight: 0.33mm; HelpURL: \\cern.ch\dfs\Applications\Altium\Datasheets\CC0201_X5R_AVX.pdf; Author: CERN DEM JLC; CreateDate: 03.12.2007; LatestRevisionDate: 03.12.2007
C104 = CC0402_10NF_16V_10%_X7R: Non-polarised capacitor; Part Description: SMD Multilayer Chip Ceramic Capacitor; Manufacturer: GENERIC; Manufacturer1 Part Number: 223878715636; Voltage: 16V; TC: X7R; Tolerance: ±10%; Part Number: CC0402_10NF_16V_10%_X7R; Component Kind: Standard; Component Type: Standard; Pin Count: 2; Value: 10nF; Status: Not Recommended; Manufacturer Part Number: CC0402_10NF_16V_10%_X7R; Case: 0402; Mounted: Yes; Socket: No; SMD: Yes; Sense: No; Manufacturer1 Example: PHYCOMP; Manufacturer1 ComponentHeight: 0.55mm; HelpURL: \\cern.ch\dfs\Applications\Altium\Datasheets\CC0402_X7R_PHYCOMP.pdf; Author: CERN DEM JLC; CreateDate: 03.12.2007; LatestRevisionDate: 03.12.2007
DL1 = DL_DS1L: Fixed SIP Delay Line; Part Description: 50 Ohm Fixed SIP Delay Line; Resistance: ± 1.0ns; Part Number: DS1L; Component Kind: Standard; Component Type: Standard; Pin Count: 2; Value: 10ns; Manufacturer: DS1L; Manufacturer Part Number: DS1L; Mounted: Yes; Socket: No; SMD: No; Sense: No; ComponentHeight: 9.2; HelpURL: \\cern.ch\dfs\Applications\Altium\Datasheets\DL_DATA-DELAY-DEVICES_1513.pdf; Author: GK; CreateDate: 07.05.2012; LatestRevisionDate: 07.05.2012
IC20 = CMP-0055-00983-1: 900 MHz Fully Differential Amplifier with Output Limiting Clamp, 8-pin LLP; Manufacturer: National Semiconductor; CompType: Amplifiers; PowerWise: Y; PackageTopMarking: XYTT*6553; PackageVersion: revA, Jan-2004; PackageDescription: LLP, Plastic, Dual, 2.5 x 3.0 x 0.8mm Body, 8 Lead, 0.5mm Pitch, No Pullback; PinCount: 8; PackageReference: SDA08C; DatasheetVersion: Nov-2008; RoHS: Y
IC32 = LMH7220MK/NOPB: High Speed Comparator with LVDS Output; Manufacturer: NATIONAL SEMICONDUCTOR; PressFit: No; Bonding: No; Part Number: LMH7220MK/NOPB; Component Kind: Standard; Component Type: Standard; Device: LMH7220MK/NOPB; PackageDescription: 0.95mm, pitch; 6 pin, 1.65mm W X 2.97mm L X 1.00mm H body IPC Medium Density; Part Description: High Speed Comparator with LVDS Output; Manufacturer Part Number: LMH7220MK/NOPB; Pin Count: 6; Case: SOT23-6; Mounted: Yes; Socket: No; SMD: Yes; Sense: No; ComponentHeight: 1mm; Author: CERN DEM JLC; HelpURL: \\cern.ch\dfs\Applications\Altium\Datasheets\LMH7220MK-NOPB.pdf; CreateDate: 30.03.2010; LatestRevisionDate: 30.03.2010
R48 R60 = R0402_20R_1%_0.0625W_100PPM: Resistor - 1%; Part Description: General Purpose Thick Film Chip Resistor; Manufacturer: GENERIC; Manufacturer1 Part Number: 232270672009L; TC: ±100ppm/°C; PressFit: No; Part Number: R0402_20R_1%_0.0625W_100PPM; Component Kind: Standard; Component Type: Standard; Pin Count: 2; Value: 20; Status: Not Recommended; Power: 0.0625W; Tolerance: ±1%; Manufacturer Part Number: R0402_20R_1%_0.0625W_100PPM; Case: 0402; Mounted: Yes; Sense: No; Socket: No; SMD: Yes; Manufacturer1 Example: YAGEO PHYCOMP; Manufacturer1 ComponentHeight: 0.4mm; HelpURL: \\cern.ch\dfs\Applications\Altium\Datasheets\R0402_Phycomp_RC0402.pdf; Author: CERN DEM JLC; CreateDate: 03.12.2007; LatestRevisionDate: 17.10.2012
R57 R59 = R0402_47R_1%_0.0625W_100PPM: Resistor - 1%; Part Description: General Purpose Thick Film Chip Resistor; Manufacturer: GENERIC; Manufacturer1 Part Number: 232270674709L; TC: ±100ppm/°C; PressFit: No; Part Number: R0402_47R_1%_0.0625W_100PPM; Component Kind: Standard; Component Type: Standard; Pin Count: 2; Value: 47; Status: Not Recommended; Power: 0.0625W; Tolerance: ±1%; Manufacturer Part Number: R0402_47R_1%_0.0625W_100PPM; Case: 0402; Mounted: Yes; Sense: No; Socket: No; SMD: Yes; Manufacturer1 Example: YAGEO PHYCOMP; Manufacturer1 ComponentHeight: 0.4mm; HelpURL: \\cern.ch\dfs\Applications\Altium\Datasheets\R0402_Phycomp_RC0402.pdf; Author: CERN DEM JLC; CreateDate: 03.12.2007; LatestRevisionDate: 17.10.2012
R58 R66 = R0201_100R_1%_0.05W_200PPM: as R122 on sheet IDX_CTRL; Part Number: R0201_100R_1%_0.05W_200PPM; Component Kind: Standard; Component Type: Standard; Pin Count: 2; Value: 100; Status: Not Recommended; Tolerance: ±1%; Manufacturer Part Number: R0201_100R_1%_0.05W_200PPM; Case: 0201; Mounted: Yes; Sense: No; Socket: No; SMD: Yes; Manufacturer1 Example: VISHAY; Manufacturer1 ComponentHeight: 0.27mm; HelpURL: \\cern.ch\dfs\Applications\Altium\Datasheets\R0201_VISHAY_CRCW0201 e3.pdf; Author: CERN DEM JLC; CreateDate: 13.11.2014; LatestRevisionDate: 13.11.2014
R61 R69 = R0402_270R_1%_0.0625W_100PPM: Resistor - 1%; Part Description: General Purpose Thick Film Chip Resistor; Manufacturer: GENERIC; Manufacturer1 Part Number: 232270672701L; TC: ±100ppm/°C; PressFit: No; Part Number: R0402_270R_1%_0.0625W_100PPM; Component Kind: Standard; Component Type: Standard; Pin Count: 2; Value: 270; Status: Not Recommended; Power: 0.0625W; Tolerance: ±1%; Manufacturer Part Number: R0402_270R_1%_0.0625W_100PPM; Case: 0402; Mounted: Yes; Sense: No; Socket: No; SMD: Yes; Manufacturer1 Example: YAGEO PHYCOMP; Manufacturer1 ComponentHeight: 0.4mm; HelpURL: \\cern.ch\dfs\Applications\Altium\Datasheets\R0402_Phycomp_RC0402.pdf; Author: CERN DEM JLC; CreateDate: 03.12.2007; LatestRevisionDate: 17.10.2012
R62 R70 = R0402_4R7_1%_0.0625W_200PPM: Resistor - 1%; Part Description: General Purpose Thick Film Chip Resistor; Manufacturer: GENERIC; Manufacturer1 Part Number: 232270674708L; TC: ±200ppm/°C; PressFit: No; Part Number: R0402_4R7_1%_0.0625W_200PPM; Component Kind: Standard; Component Type: Standard; Pin Count: 2; Value: 4R7; Status: Not Recommended; Power: 0.0625W; Tolerance: ±1%; Manufacturer Part Number: R0402_4R7_1%_0.0625W_200PPM; Case: 0402; Mounted: Yes; Sense: No; Socket: No; SMD: Yes; Manufacturer1 Example: YAGEO PHYCOMP; Manufacturer1 ComponentHeight: 0.4mm; HelpURL: \\cern.ch\dfs\Applications\Altium\Datasheets\R0402_Phycomp_RC0402.pdf; Author: CERN DEM JLC; CreateDate: 03.12.2007; LatestRevisionDate: 17.10.2012
R63 R64 R68 = R0402_120R_1%_0.0625W_100PPM: Resistor - 1%; Part Description: General Purpose Thick Film Chip Resistor; Manufacturer: GENERIC; Manufacturer1 Part Number: 232270671201L; TC: ±100ppm/°C; PressFit: No; Part Number: R0402_120R_1%_0.0625W_100PPM; Component Kind: Standard; Component Type: Standard; Pin Count: 2; Value: 120; Status: Not Recommended; Power: 0.0625W; Tolerance: ±1%; Manufacturer Part Number: R0402_120R_1%_0.0625W_100PPM; Case: 0402; Mounted: Yes; Sense: No; Socket: No; SMD: Yes; Manufacturer1 Example: YAGEO PHYCOMP; Manufacturer1 ComponentHeight: 0.4mm; HelpURL: \\cern.ch\dfs\Applications\Altium\Datasheets\R0402_Phycomp_RC0402.pdf; Author: CERN DEM JLC; CreateDate: 03.12.2007; LatestRevisionDate: 17.10.2012
R65 = R0402_160R_1%_0.0625W_100PPM: Resistor - 1%; Part Description: General Purpose Thick Film Chip Resistor; Manufacturer: GENERIC; Manufacturer1 Part Number: 232270671601L; TC: ±100ppm/°C; PressFit: No; Part Number: R0402_160R_1%_0.0625W_100PPM; Component Kind: Standard; Component Type: Standard; Pin Count: 2; Value: 160; Status: Not Recommended; Power: 0.0625W; Tolerance: ±1%; Manufacturer Part Number: R0402_160R_1%_0.0625W_100PPM; Case: 0402; Mounted: Yes; Sense: No; Socket: No; SMD: Yes; Manufacturer1 Example: YAGEO PHYCOMP; Manufacturer1 ComponentHeight: 0.4mm; HelpURL: \\cern.ch\dfs\Applications\Altium\Datasheets\R0402_Phycomp_RC0402.pdf; Author: CERN DEM JLC; CreateDate: 03.12.2007; LatestRevisionDate: 17.10.2012
R67 = R0402_51R_1%_0.0625W_100PPM: Resistor - 1%; Part Description: General Purpose Thick Film Chip Resistor; Manufacturer: GENERIC; Manufacturer1 Part Number: 232270675109L; TC: ±100ppm/°C; PressFit: No; Part Number: R0402_51R_1%_0.0625W_100PPM; Component Kind: Standard; Component Type: Standard; Pin Count: 2; Value: 51; Status: Not Recommended; Power: 0.0625W; Tolerance: ±1%; Manufacturer Part Number: R0402_51R_1%_0.0625W_100PPM; Case: 0402; Mounted: Yes; Sense: No; Socket: No; SMD: Yes; Manufacturer1 Example: YAGEO PHYCOMP; Manufacturer1 ComponentHeight: 0.4mm; HelpURL: \\cern.ch\dfs\Applications\Altium\Datasheets\R0402_Phycomp_RC0402.pdf; Author: CERN DEM JLC; CreateDate: 03.12.2007; LatestRevisionDate: 17.10.2012

## Sheet DACs.SchDoc: FMC_ADC
size 420 x 297 mm; Author: G.Kasprowicz; CompanyName: WUT ISE; DrawnBy: G.Kasprowicz; Organization: WUT ISE; Address1: PW ISE; Address2: Nowowiejska 15/19 00-665 Warsaw; Address3: gkasprow@gmail.com; DocumentNumber: 11; Revision: 2; SheetNumber: 11; SheetTotal: 12; ModifiedBy: -; CheckedDate: -; Title2: CFD Offset DAC; DivGrp: WUT ISE; Designer: G.Kasprowicz; ModifiedDate: -; ProjectName: Sensor Box
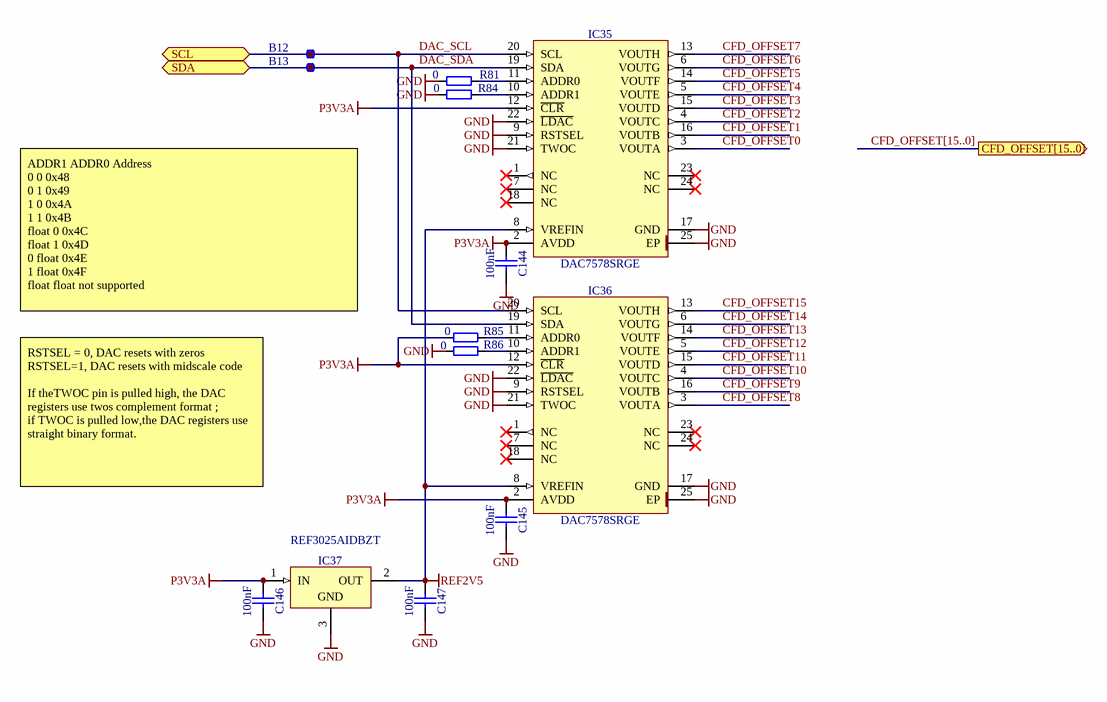
[diagram p9: DACs.SchDoc]

### Parts
B12  SMD Pad  [C100]  (value not drawn)
B13  SMD Pad  [C100]  (value not drawn)
C144  100nF  [CAPC0603X33N]
C145  100nF  [CAPC0603X33N]
C146  100nF  [CAPC0603X33N]
C147  100nF  [CAPC0603X33N]
IC35  DAC7578SRGE  [QFN50P400X400X100-25N-S280]
IC36  DAC7578SRGE  [QFN50P400X400X100-25N-S280]
IC37  REF3025AIDBZT  [SOT95P237X112-3N]
R81  0  [RESC1005X40N]
R84  0  [RESC1005X40N]
R85  0  [RESC1005X40N]
R86  0  [RESC1005X40N]

### Ports
CFD_OFFSET[15..0] (out), SCL (bidir), SDA (bidir)

### Nets
GND: C144.2 C145.2 C146.2 C147.2 IC35.9(RSTSEL) IC35.17(GND) IC35.21(TWOC) IC35.22(~{LDAC}) IC35.25(EP) IC36.9(RSTSEL) IC36.17(GND) IC36.21(TWOC) IC36.22(~{LDAC}) IC36.25(EP) IC37.3(GND) R81.1 R84.1 R86.1
P3V3A: C144.1 C145.1 C146.1 IC35.2(AVDD) IC35.12(~{CLR}) IC36.2(AVDD) IC36.12(~{CLR}) IC37.1(IN) R85.1  [project net DVDD33]
REF2V5: C147.1 IC35.8(VREFIN) IC36.8(VREFIN) IC37.2(OUT)
CFD_OFFSET0: IC35.3(VOUTA)
CFD_OFFSET1: IC35.16(VOUTB)
CFD_OFFSET2: IC35.4(VOUTC)
CFD_OFFSET3: IC35.15(VOUTD)
CFD_OFFSET4: IC35.5(VOUTE)
CFD_OFFSET5: IC35.14(VOUTF)
CFD_OFFSET6: IC35.6(VOUTG)
CFD_OFFSET7: IC35.13(VOUTH)
CFD_OFFSET8: IC36.3(VOUTA)
CFD_OFFSET9: IC36.16(VOUTB)
CFD_OFFSET10: IC36.4(VOUTC)
CFD_OFFSET11: IC36.15(VOUTD)
CFD_OFFSET12: IC36.5(VOUTE)
CFD_OFFSET13: IC36.14(VOUTF)
CFD_OFFSET14: IC36.6(VOUTG)
CFD_OFFSET15: IC36.13(VOUTH)
DAC_SCL: B12.1 IC35.20(SCL) IC36.20(SCL) ; port SCL
DAC_SDA: B13.1 IC35.19(SDA) IC36.19(SDA) ; port SDA
NetIC35_10: IC35.10(ADDR1) R84.2
NetIC35_11: IC35.11(ADDR0) R81.2
NetIC36_10: IC36.10(ADDR1) R86.2
NetIC36_11: IC36.11(ADDR0) R85.2

Not connected (* = marked no-connect by the designer): IC35 1(NC)* 7(NC)* 18(NC)* 23(NC)* 24(NC)*; IC36 1(NC)* 7(NC)* 18(NC)* 23(NC)* 24(NC)*

### Buses and harness runs
bus CFD_OFFSET[15..0] = port CFD_OFFSET[15..0]

### Notes on the sheet
- ADDR1	ADDR0	Address
  0	0	0x48
  0	1	0x49
  1	0	0x4A
  1	1	0x4B
  float	0	0x4C
  float	1	0x4D
  0	float	0x4E
  1	float	0x4F
  float	float	not supported
- RSTSEL = 0, DAC resets with zeros
  RSTSEL=1, DAC resets with midscale code
  If theTWOC pin is pulled high, the DAC registers use twos complement format ;
  if TWOC is pulled low,the DAC registers use straight binary format.
- Project/Equipment
- Document
- Designer
- Drawn by
- Check.by
- Copyright WUT ISE 2018.
  This documentation describes Open Hardware and is licensed under the CERN OHL v.1.1. You may redistribute and modify this documentation under the terms of the CERN OHL v.1.1. (http://ohwr.org/CERNOHL). This documentation is distributed WITHOUT ANY EXPRESS OR IMPLIED WARRANTY, INCLUDING OF MERCHANTABILITY, SATISFACTORY QUALITY AND FITNESS FOR A PARTICULAR PURPOSE. Please see the CERN OHL v.1.1 for applicable conditions.
- Contact
- File
- Last Mod.
- Print Date
- Sheet
- Size
- A3
- of
- Rev

### Library data of the parts
B12 B13 = SMD_PAD_D1MM: Through Hole Pad; Part Description: 1mm Diameter SMD Pad; Mounted: No; Part Number: SMD_PAD_D1MM; Component Kind: Standard (No BOM); Component Type: Standard (No BOM); Pin Count: 1; Family: SMD Pad; Socket: No; SMD: No; Sense: No; Status: None; ComponentHeight: 0mm; HelpURL: Undefined; Author: CERN DEM JLC; CreateDate: 10.10.2017; LatestRevisionDate: 10.10.2017; PackageDescription: 1mm Diameter SMD Pad
C144-C147 = CC0201_100NF_6.3V_10%_X5R: as C184 on sheet IDX_CTRL; Part Number: CC0201_100NF_6.3V_10%_X5R; Component Kind: Standard; Component Type: Standard; Pin Count: 2; Value: 100nF; Status: Not Recommended; Manufacturer Part Number: CC0201_100NF_6.3V_10%_X5R; Case: 0201; Mounted: Yes; Socket: No; SMD: Yes; Sense: No; Manufacturer1 Example: AVX; Manufacturer1 ComponentHeight: 0.33mm; HelpURL: \\cern.ch\dfs\Applications\Altium\Datasheets\CC0201_X5R_AVX.pdf; Author: CERN DEM JLC; CreateDate: 03.12.2007; LatestRevisionDate: 03.12.2007
IC35 IC36 = DAC7578SRGE: 8-Bit, Octal-Channel, Ultra-Low Glitch, Voltage Output, Two-Wire Interface Digital-to-Analog Converter; Part Description: 12-Bit, Octal-Channel, Ultra-Low Glitch, Voltage Output, Two-Wire Interface Digital-To-Analog Converters; Manufacturer: TEXAS INSTRUMENTS; PressFit: No; Bonding: No; Part Number: DAC7578SRGE; Component Kind: Standard; Component Type: Standard; Device: DAC7578SRGE; PackageDescription: QFN, 0.50mm Pitch, Square; 24 Pin, 4.00mm L X 4.00mm W X 1.00mm H body(w/thermal tab 2.8 X 2.8mm), IPC Medium Density; Manufacturer Part Number: DAC7578SRGE; Pin Count: 25; Case: QFN24; Mounted: Yes; Socket: No; SMD: Yes; Sense: No; ComponentHeight: 1mm; Author: CERN DEM MR; HelpURL: \\cern.ch\dfs\Applications\Altium\Datasheets\DAC7578SRGE.pdf; CreateDate: 14.07.2016; LatestRevisionDate: 14.07.2016
IC37 = REF3025AIDBZT: 3-Terminal Regulator 1=IN 2=OUT 3=GND; Part Description: 2.5V, 50ppm/°C Max, 50uA, CMOS Voltage Reference; Manufacturer: TEXAS INSTRUMENTS; PressFit: No; Bonding: No; Part Number: REF3025AIDBZT; Component Kind: Standard; Component Type: Standard; Device: REF3025AIDBZT; PackageDescription: SOT, 0.95mm, pitch; 3 pin,1.30mm W X 2.92mm L X 1.12mm H body, IPC Medium Density; Manufacturer Part Number: REF3025AIDBZT; Pin Count: 3; Case: SOT23; Mounted: Yes; Socket: No; SMD: Yes; Sense: No; ComponentHeight: 1.12mm; HelpURL: \\cern.ch\dfs\Applications\Altium\Datasheets\REF3025AIDBZT.pdf; Author: CERN DEM JLC; CreateDate: 19.12.2016; LatestRevisionDate: 19.12.2016
R81 R84-R86 = R0402_0R_JUMPER: Resistor; Part Description: 1A (0.05R Max DC Resistance) Zero Ohm Jumper; Manufacturer: GENERIC; Manufacturer1 Part Number: 232270591001L; PressFit: No; Part Number: R0402_0R_JUMPER; Component Kind: Standard; Component Type: Standard; Pin Count: 2; Value: 0; Status: Not Recommended; Manufacturer Part Number: R0402_0R_JUMPER; Case: 0402; Mounted: Yes; Sense: No; Socket: No; SMD: Yes; Manufacturer1 Example: YAGEO PHYCOMP; Manufacturer1 ComponentHeight: 0.4mm; HelpURL: \\cern.ch\dfs\Applications\Altium\Datasheets\R0402_Phycomp_RC0402.pdf; Author: CERN DEM JLC; CreateDate: 03.12.2007; LatestRevisionDate: 17.10.2012